# EAGLE design Micro_Rev1j (EAGLE 7.7.0)
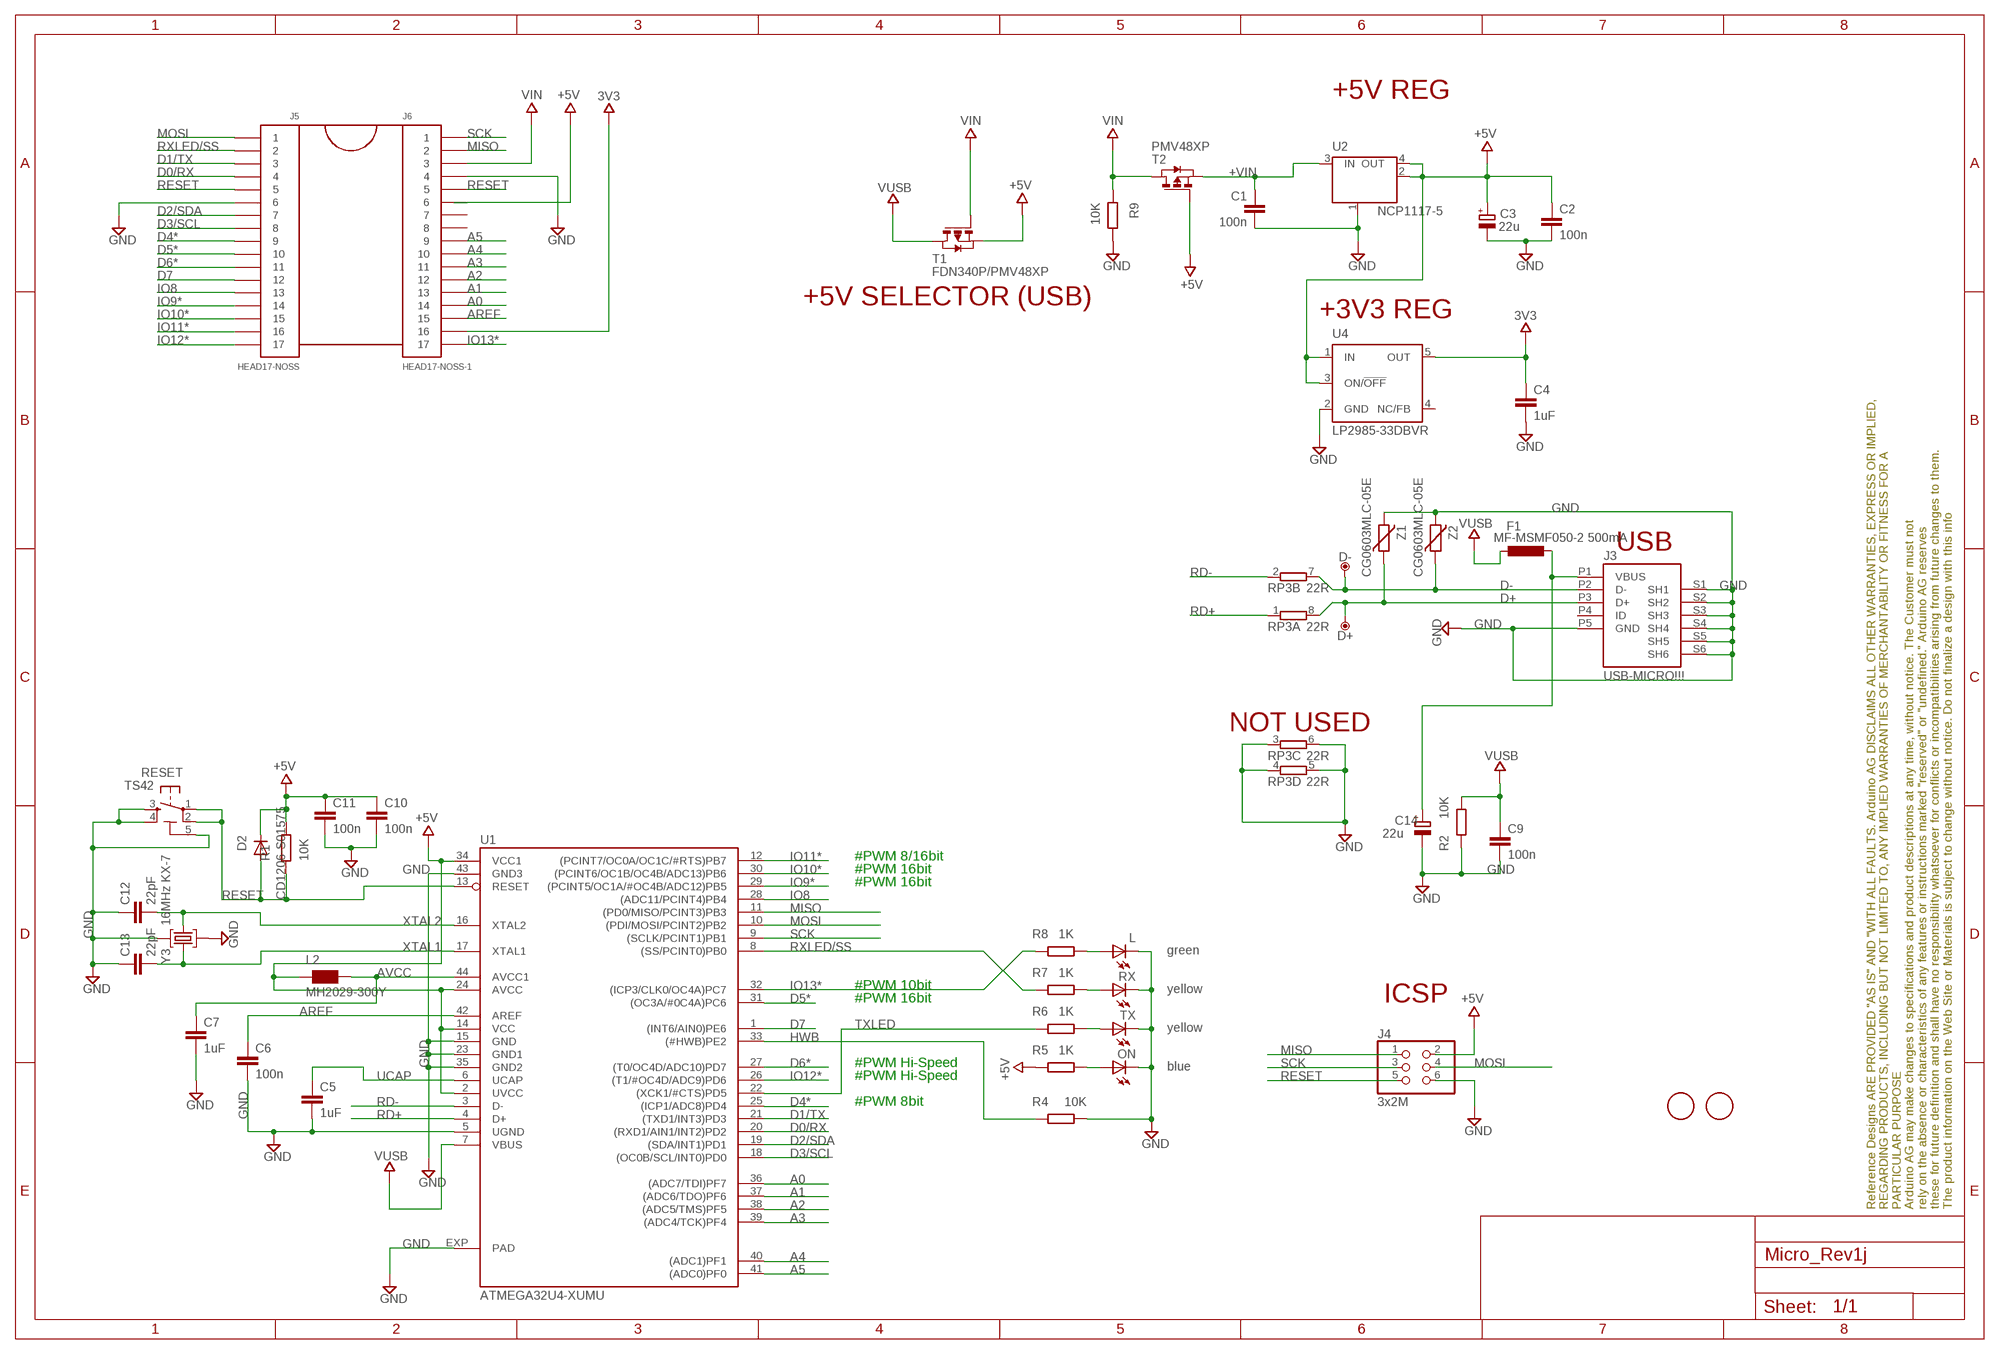
[diagram p0: schematic, sheet 1]

## Parts
C1  100n  C-EUC0402  [C0402]
C2  100n  C-EUC0402  [C0402]
C3  22u  CPOL-EUSMCB  [SMC_B]
C4  1uF  C-EUC0402  [C0402]
C5  1uF  C-EUC0402  [C0402]
C6  100n  C-EUC0402  [C0402]
C7  1uF  C-EUC0402  [C0402]
C9  100n  C-EUC0402  [C0402]
C10  100n  C-EUC0402  [C0402]
C11  100n  C-EUC0402  [C0402]
C12  22pF  C-EUC0402  [C0402]
C13  22pF  C-EUC0402  [C0402]
C14  22u  CPOL-EUSMCB  [SMC_B]
D2  CD1206-S01575  DIODE-MINIMELF  [MINIMELF]
D+  DNP  TPTP-1.00MM  [TP-1.00MM]
D-  DNP  TPTP-1.00MM  [TP-1.00MM]
F1  MF-MSMF050-2 500mA  L-EUL1812  [L1812]
FRAME1  DNP  A3-FRAME-STANDARD  [FRAME]
J3  USB-MICRO!!!  MYCON2_USB-MINI-B  [CON2_USB_MICRO_B_AT]
J4  3x2M  PINHD-2X3  [2X03]
J5  HEAD17-NOSS  [HEAD17-NOSS]
J6  HEAD17-NOSS-1  [HEAD17-NOSS-1]
L  green  LEDCHIPLED_0805  [CHIPLED_0805]
L2  MH2029-300Y  WE-CBF_0805  [0805]
ON  blue  LEDCHIPLED_0805  [CHIPLED_0805]
R1  10K  R-EU_R0402  [R0402]
R2  10K  R-EU_R0402  [R0402]
R4  10K  R-EU_R0402  [R0402]
R5  1K  R-EU_R0402  [R0402]
R6  1K  R-EU_R0402  [R0402]
R7  1K  R-EU_R0402  [R0402]
R8  1K  R-EU_R0402  [R0402]
R9  10K  R-EU_R0402  [R0402]
RESET  TS42  [TS42]
RP3  22R  4R-NCAY16  [CAY16]
RX  yellow  LEDCHIPLED_0805  [CHIPLED_0805]
T1  FDN340P/PMV48XP  PMOSSOT23  [SOT-23]
T2  PMV48XP  PMOSSOT23  [SOT-23]
TX  yellow  LEDCHIPLED_0805  [CHIPLED_0805]
U1  ATMEGA32U4-XUMU  [QFN44ML7X7]
U2  NCP1117-5  LINEAR_MC33269ST  [SOT223]
U4  LP2985-33DBVR  LP2985-XXDBVR33  [SOT23-DBV]
U$37  DNP  FIDUCIAL-1.5MM  [FD-1-1.5]
U$53  DNP  FIDUCIAL-1.5MM  [FD-1-1.5]
Y3  16MHz KX-7  CRYSTAL-3.2-2.5  [CRYSTAL-3.2-2.5]
Z1  CG0603MLC-05E  VARISTORCN0603  [CT/CN0603]
Z2  CG0603MLC-05E  VARISTORCN0603  [CT/CN0603]

## Nets
3V3: C4.1 J6.16 U4.5(OUT)
+5V: C2.1 C3.+ C10.1 C11.1 D2.C J4.2 J6.6 L2.1 R1.1 R5.1 T1.2(S) T2.3(G) U1.2(UVCC) U1.14(VCC) U1.24(AVCC) U1.34(VCC1) U2.2(OUT) U2.4(OUT) U4.1(IN) U4.3(ON/!OFF)
+VIN: C1.1 T2.2(S) U2.3(IN)
A0: J6.14 U1.36((ADC7/TDI)PF7)
A1: J6.13 U1.37((ADC6/TDO)PF6)
A2: J6.12 U1.38((ADC5/TMS)PF5)
A3: J6.11 U1.39((ADC4/TCK)PF4)
A4: J6.10 U1.40((ADC1)PF1)
A5: J6.9 U1.41((ADC0)PF0)
AREF: C6.1 J6.15 U1.42(AREF)
AVCC: C7.1 L2.2 U1.44(AVCC1)
D0/RX: J5.4 U1.20((RXD1/AIN1/INT2)PD2)
D1/TX: J5.3 U1.21((TXD1/INT3)PD3)
D2/SDA: J5.7 U1.19((SDA/INT1)PD1)
D3/SCL: J5.8 U1.18((OC0B/SCL/INT0)PD0)
D4*: J5.9 U1.25((ICP1/ADC8)PD4)
D5*: J5.10 U1.31((OC3A/#0C4A)PC6)
D6*: J5.11 U1.27((T0/OC4D/ADC10)PD7)
D7: J5.12 U1.1((INT6/AIN0)PE6)
D+: D+.X J3.P3(D+) RP3.8 Z1.1
D-: D-.X J3.P2(D-) RP3.7 Z2.1
GND: C1.2 C2.2 C3.- C4.2 C5.2 C6.2 C7.2 C9.2 C10.2 C11.2 C12.1 C13.1 C14.- J3.P5(GND) J3.S1(SH1) J3.S2(SH2) J3.S3(SH3) J3.S4(SH4) J3.S5(SH5) J3.S6(SH6) J4.6 J5.6 J6.4 L.C ON.C R2.1 R4.2 R9.1 RESET.3 RESET.4 RESET.5(5-GND) RP3.3 RP3.4 RP3.5 RP3.6 RX.C TX.C U1.5(UGND) U1.15(GND) U1.23(GND1) U1.35(GND2) U1.43(GND3) U1.EXP(PAD) U2.1(GND/ADJ) U4.2(GND) Y3.2(GND) Y3.4(GND) Z1.2 Z2.2
HWB: R4.1 U1.33((#HWB)PE2)
IO8: J5.13 U1.28((ADC11/PCINT4)PB4)
IO9*: J5.14 U1.29((PCINT5/OC1A/#OC4B/ADC12)PB5)
IO10*: J5.15 U1.30((PCINT6/OC1B/OC4B/ADC13)PB6)
IO11*: J5.16 U1.12((PCINT7/OC0A/OC1C/#RTS)PB7)
IO12*: J5.17 U1.26((T1/#OC4D/ADC9)PD6)
IO13*: J6.17 R8.1 U1.32((ICP3/CLK0/OC4A)PC7)
MISO: J4.1 J6.2 U1.11((PD0/MISO/PCINT3)PB3)
MOSI: J4.4 J5.1 U1.10((PDI/MOSI/PCINT2)PB2)
N$2: R7.2 RX.A
N$3: ON.A R5.2
N$4: R6.2 TX.A
N$7: L.A R8.2
RD+: RP3.1 U1.4(D+)
RD-: RP3.2 U1.3(D-)
RESET: D2.A J4.5 J5.5 J6.5 R1.2 RESET.1 RESET.2 U1.13(RESET)
RXLED/SS: J5.2 R7.1 U1.8((SS/PCINT0)PB0)
SCK: J4.3 J6.1 U1.9((SCLK/PCINT1)PB1)
TXLED: R6.1 U1.22((XCK1/#CTS)PD5)
UCAP: C5.1 U1.6(UCAP)
VIN: J6.3 R9.2 T1.3(G) T2.1(D)
VUSB: C9.1 F1.2 R2.2 T1.1(D) U1.7(VBUS)
VUSBD: C14.+ F1.1 J3.P1(VBUS)
XTAL1: C13.2 U1.17(XTAL1) Y3.3(C2)
XTAL2: C12.2 U1.16(XTAL2) Y3.1(C1)
Unconnected: J3.P4(ID) J6.7 J6.8 U4.4(NC/FB)

## Notes on the sheet
- +5V REG
- +5V SELECTOR (USB)
- +3V3 REG
- USB
- NOT USED
- #PWM 8/16bit
- #PWM 16bit
- #PWM 16bit
- #PWM 10bit
- #PWM 16bit | ICSP
- #PWM Hi-Speed
- #PWM Hi-Speed
- #PWM 8bit

## Library data of the parts
C1 C2 C4-C7 C9-C13 = gen_comp:C-EU: CAPACITOR, European symbol
C3 C14 = rcl:CPOL-EU: POLARIZED CAPACITOR, European symbol
D2 = diode:DIODE-: DIODE
D+ D- = Arduino-utility:TP: Testpoint; DATASHEET: DNP; DISTRIBUTOR-LINK: DNP; DISTRIBUTOR-PN: DNP; MANUFACTURER: DNP; MANUFACTURER-PN: DNP
F1 = rcl:L-EU: INDUCTOR, European symbol
FRAME1 = Arduino-utility:A3-FRAME: Schematic frame; DATASHEET: DNP; DISTRIBUTOR-LINK: DNP; DISTRIBUTOR-PN: DNP; MANUFACTURER: DNP; MANUFACTURER-PN: DNP
J3 = gen_comp:MYCON2_USB-MINI-B
J4 = gen_comp:PINHD-2X3: PIN HEADER
J5 = gen_comp:HEAD17-NOSS
J6 = gen_comp:HEAD17-NOSS-1
L ON RX TX = led:LED: LED OSRAM: - CHIPLED LG R971, LG N971, LY N971, LG Q971, LY Q971, LO R971, LY R971 LH N974, LH R974 LS Q976, LO Q976, LY Q976 LO Q996 - Hyper CHIPLED LW Q18S LB Q993, LB Q99A, LB R99A - SideLED LS A670, LO A670, LY A670, LG A670, LP A670 LB A673, LV A673, LT A673, LW A673 LH A674 LY A675 LS A676, LA A676, LO A676, LY A676, LW A676 LS A679, LY A679, LG A679 - Hyper Micro SIDELED® LS Y876, LA Y876, LO Y876, LY Y876 LT Y87S - SmartLED LW L88C, LW L88S LB L89C, LB L89S, LG L890 LS L89K, LO L89K, LY L89K LS L896, LA L896, LO L896, LY L896 - TOPLED LS T670, LO T670, LY T670, LG T670, LP T670 LSG T670, LSP T670, LSY T670, LOP T670, LYG T670 LG T671, LOG T671, LSG T671 LB T673, LV T673, LT T673, LW T673 LH T674 LS T676, LA T676, LO T676, LY T676, LB T676, LH T676, LSB T676, LW T676 LB T67C, LV T67C, LT T67C, LS T67K, LO T67K, LY T67K, LW E67C LS E67B, LA E67B, LO E67B, LY E67B, LB E67C, LV E67C, LT E67C LW T67C LS T679, LY T679, LG T679 LS T770, LO T770, LY T770, LG T770, LP T770 LB T773, LV T773, LT T773, LW T773 LH T774 LS E675, LA E675, LY E675, LS T675 LS T776, LA T776, LO T776, LY T776, LB T776 LHGB T686 LT T68C, LB T68C - Hyper Mini TOPLED® LB M676 - Mini TOPLED Santana® LG M470 LS M47K, LO M47K, LY M47K Source: http://www.osram.convergy.de LUXEON: - LUMILED® LXK2-PW12-R00, LXK2-PW12-S00, LXK2-PW14-U00, LXK2-PW14-V00 LXK2-PM12-R00, LXK2-PM12-S00, LXK2-PM14-U00 LXK2-PE12-Q00, LXK2-PE12-R00, LXK2-PE12-S00, LXK2-PE14-T00, LXK2-PE14-U00 LXK2-PB12-K00, LXK2-PB12-L00, LXK2-PB12-M00, LXK2-PB14-N00, LXK2-PB14-P00, LXK2-PB14-Q00 LXK2-PR12-L00, LXK2-PR12-M00, LXK2-PR14-Q00, LXK2-PR14-R00 LXK2-PD12-Q00, LXK2-PD12-R00, LXK2-PD12-S00 LXK2-PH12-R00, LXK2-PH12-S00 LXK2-PL12-P00, LXK2-PL12-Q00, LXK2-PL12-R00 Source: www.luxeon.com KINGBRIGHT: KA-3528ASYC Source: www.kingbright.com
L2 = wuerth-elektronik:WE-CBF: SMD EMI Suppression Ferrite Beads - excellent anti-EMI properties - low DCR - impedances till 3000 ohms - rated current up to 6 A
R1 R2 R4-R9 = gen_comp:R-EU_: RESISTOR, European symbol
RESET = Arduino:TS42: TS42 Dongnan Electronics Tact switch VDC 12V - 50mA
RP3 = resistor-dil:4R-N: Array Chip Resistor Source: RS Component / Phycomp
T1 T2 = zetex:PMOSSOT23: MOS FET
U1 = gen_comp:ATMEGA32U4-XU
U2 = gen_comp:LINEAR_MC33269ST*: Adjustable Output Low Dropout Voltage Regulator 800 mA Source: http://www.onsemi.com/pub/Collateral/MC33269-D.PDF
U4 = gen_comp:LP2985-XXDBVR: ULTRALOW-POWER 50-mA LOW-DROPOUT LINEAR REGULATORS 50-mA Low-Dropout Regulator Source: http://focus.ti.com/lit/ds/symlink/tps77001.pdf
U$37 U$53 = Arduino-utility:FIDUCIAL: Fiducial mount; DATASHEET: DNP; DISTRIBUTOR-LINK: DNP; DISTRIBUTOR-PN: DNP; MANUFACTURER: DNP; MANUFACTURER-PN: DNP
Y3 = gen_comp:CRYSTAL-3.2-2.5
Z1 Z2 = varistor:VARISTOR: VARISTOR

## Net classes
0 default: width 0.254 mm, drill 0.5 mm, clearance 0.203 mm

## Board
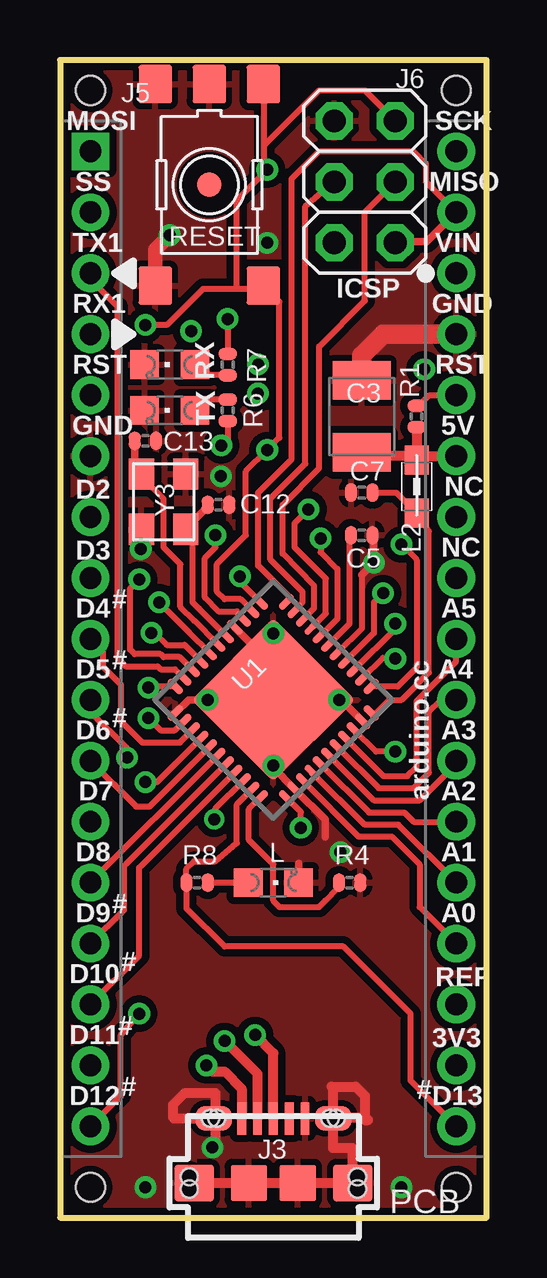
[diagram p1: board, top side]
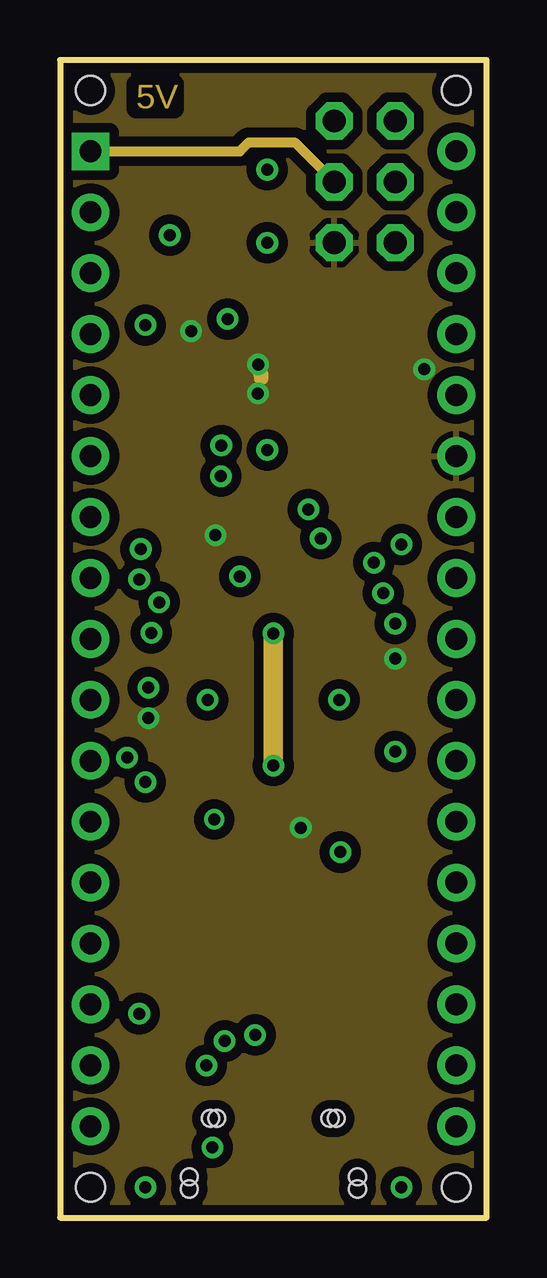
[diagram p2: board, inner layer POWER]
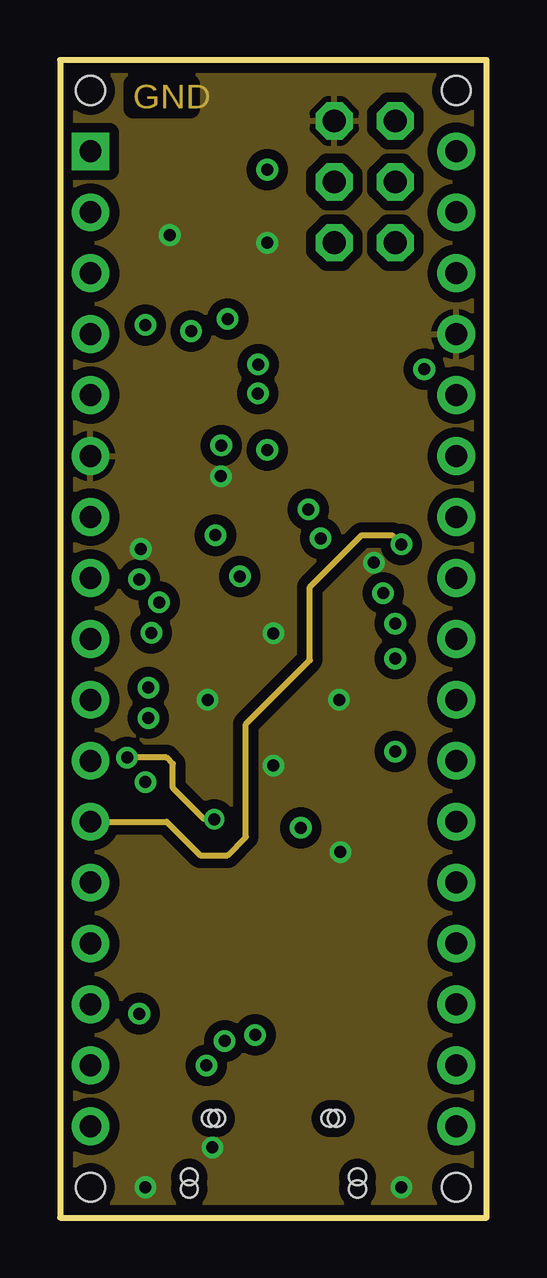
[diagram p3: board, inner layer GROUND]
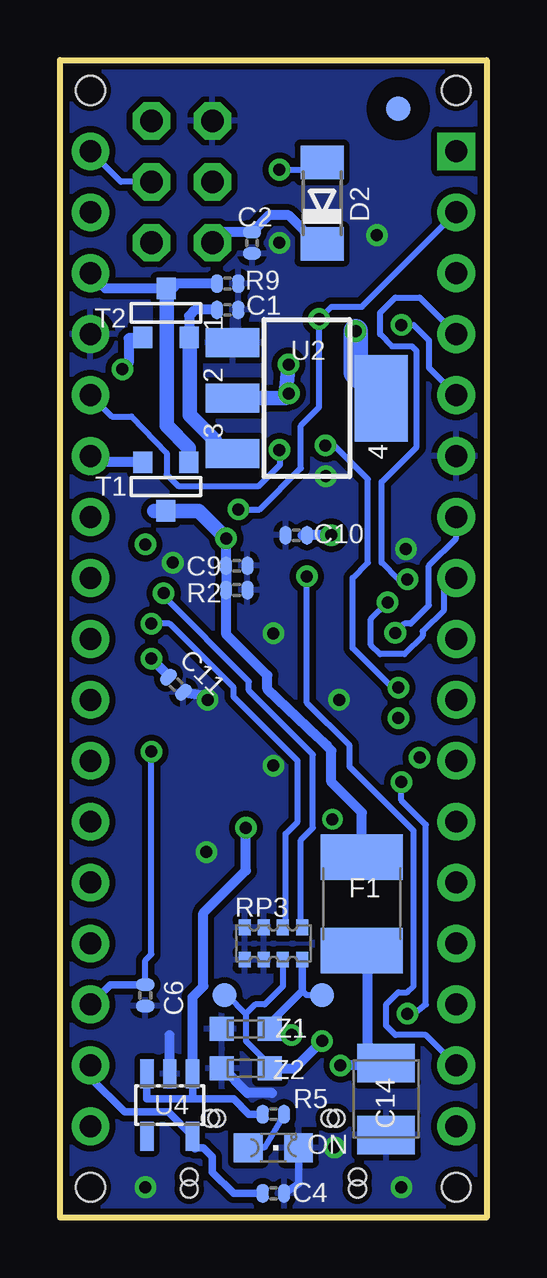
[diagram p4: board, bottom side, seen from below]

Size 17.78 x 48.26 mm. Coordinates in mm from the lower left corner, seen from the top.
Outline: 0,0 17.78,0 17.78,48.26 0,48.26 0,0
Copper layers (1*2*15*16): Top 0.035mm / dielectric 0.2mm / POWER 0.0175mm / dielectric 0.3mm / GROUND 0.0175mm / dielectric 0.2mm / Bottom 0.035mm
Design rules "SystemElettronica": minimum track width 6mil, minimum drill 0.499mm, track to track 6mil, track to pad 6mil, pad to pad 5mil, via to via 5mil, smd to smd 0mil, copper to edge 10mil, drill to drill 8mil, minimum pad ring 6mil, minimum via ring 4mil, stop-mask expansion 4mil, vias tented up to drill 25mil, thermal gap 10mil
Holes 1.2 mm at 1.27,1.27 16.51,1.27 1.27,46.99 16.51,46.99

### Footprints (pad centres in the part's own frame; a part is rotated, then mirrored left to right if it is on the bottom)
C0402 = smd 0.508 x 0.762: 1 -0.445,0; 2 0.445,0
SMC_B = smd 1.6 x 2.4: + -1.5,0; - 1.5,0
MINIMELF = smd 1.4 x 1.8: A 1.7,0; C -1.7,0
TP-1.00MM = smd 1 x 1 bottom: X 0,0
L1812 = smd 1.9 x 3.4: 1 -1.95,0; 2 1.95,0
CON2_USB_MICRO_B_AT = smd 0.406 x 1.346: P1 -1.321,2.692; P2 -0.66,2.692; P3 0,2.692; P4 0.66,2.692; P5 1.321,2.692 | smd 1.651 x 1.549: S1 -3.302,0; S2 3.302,0 | smd 1.524 x 1.016: S3 -2.489,2.692; S4 2.489,2.692 | smd 1.524 x 1.524: S5 -1.016,0; S6 1.016,0 | hole 0.7: -3.505,0.254; -3.505,-0.254; 3.505,0.254; 3.505,-0.254; -2.616,2.692; -2.362,2.692; 2.362,2.692; 2.616,2.692
2X03 = drill 0.95 pad 1.55 octagon: 1 -2.54,-1.27; 2 -2.54,1.27; 3 0,-1.27; 4 0,1.27; 5 2.54,-1.27; 6 2.54,1.27
HEAD17-NOSS = drill 0.914 pad 1.575 square: 1 0,0 | drill 0.914 pad 1.575: 2 2.54,0; 3 5.08,0; 4 7.62,0; 5 10.16,0; 6 12.7,0; 7 15.24,0; 8 17.78,0; 9 20.32,0; 10 22.86,0; 11 25.4,0; 12 27.94,0; 13 30.48,0; 14 33.02,0; 15 35.56,0; 16 38.1,0; 17 40.64,0
HEAD17-NOSS-1 = drill 0.914 pad 1.575: 1 0,0; 2 2.54,0; 3 5.08,0; 4 7.62,0; 5 10.16,0; 6 12.7,0; 7 15.24,0; 8 17.78,0; 9 20.32,0; 10 22.86,0; 11 25.4,0; 12 27.94,0; 13 30.48,0; 14 33.02,0; 15 35.56,0; 16 38.1,0; 17 40.64,0
CHIPLED_0805 = smd 1.2 x 1.2: A 0,-1.05; C 0,1.05
0805 = smd 1.2 x 1: 1 -1.1,0; 2 1.1,0
R0402 = smd 0.508 x 0.762: 1 -0.445,0; 2 0.445,0
TS42 = smd 1.6 x 1.4: 1 -4.2,2.25; 2 4.2,2.25; 3 -4.2,-2.25; 4 4.2,-2.25; 5 -4.2,0
CAY16 = smd 0.5 x 0.65: 1 -1.2,-0.675; 2 -0.4,-0.675; 3 0.4,-0.675; 4 1.2,-0.675; 5 1.2,0.675; 6 0.4,0.675; 7 -0.4,0.675; 8 -1.2,0.675
SOT-23 = smd 0.787 x 0.889: 1 0.025,-1.016; 2 -0.94,1.016; 3 0.991,1.016
QFN44ML7X7 = smd 0.75 x 0.275: 1 -3.275,2.5; 2 -3.275,2; 3 -3.275,1.5; 4 -3.275,1; 5 -3.275,0.5; 6 -3.275,0; 7 -3.275,-0.5; 8 -3.275,-1; 9 -3.275,-1.5; 10 -3.275,-2; 11 -3.275,-2.5; 23 3.275,-2.5; 24 3.275,-2; 25 3.275,-1.5; 26 3.275,-1; 27 3.275,-0.5; 28 3.275,0; 29 3.275,0.5; 30 3.275,1; 31 3.275,1.5; 32 3.275,2; 33 3.275,2.5 | smd 0.275 x 0.75: 12 -2.5,-3.275; 13 -2,-3.275; 14 -1.5,-3.275; 15 -1,-3.275; 16 -0.5,-3.275; 17 0,-3.275; 18 0.5,-3.275; 19 1,-3.275; 20 1.5,-3.275; 21 2,-3.275; 22 2.5,-3.275; 34 2.5,3.275; 35 2,3.275; 36 1.5,3.275; 37 1,3.275; 38 0.5,3.275; 39 0,3.275; 40 -0.5,3.275; 41 -1,3.275; 42 -1.5,3.275; 43 -2,3.275; 44 -2.5,3.275 | smd 4.826 x 4.826: EXP 0,0
SOT223 = smd 1.219 x 2.235: 1 -2.311,-3.099; 2 0,-3.099; 3 2.311,-3.099 | smd 3.6 x 2.2: 4 0,3.099
SOT23-DBV = smd 0.55 x 1.2: 1 -0.95,-1.3; 2 0,-1.3; 3 0.95,-1.3; 4 0.95,1.3; 5 -0.95,1.3
FD-1-1.5 = smd 1.016 x 1.016: P$1 0,0
CRYSTAL-3.2-2.5 = smd 1.3 x 1.05: 1 -1.15,-0.925; 2 1.15,-0.925; 3 1.15,0.925; 4 -1.15,0.925
CT/CN0603 = smd 1 x 1: 1 -1,0; 2 1,0

### Placement (x,y rotation side)
C1  10.79,37.85 0 bottom
C2  9.78,40.64 270 bottom
C3  12.57,33.4 90 top
C4  8.89,1.02 0 bottom
C5  12.57,28.45 0 top
C6  14.22,9.27 270 bottom
C7  12.57,30.23 180 top
C9  10.41,27.18 0 bottom
C10  7.94,28.45 180 bottom
C11  12.95,22.23 315 bottom
C12  6.6,29.72 180 top
C13  3.56,32.38 180 top
C14  4.19,4.95 270 bottom
D2  6.86,42.29 90 bottom
D+  6.86,9.27 0 top
D-  10.92,9.27 0 top
F1  5.21,13.08 90 bottom
FRAME1  -59.18,-6.35 0 top  (outside the outline)
J3  8.89,1.45 0 top
J4  12.7,43.18 90 top
J5  1.27,44.45 270 top
J6  16.51,44.45 270 top
L  8.89,13.97 270 top
L2  14.86,30.48 270 top
ON  8.89,2.92 270 bottom
R1  14.86,33.4 90 top
R2  10.41,26.16 180 bottom
R4  12.06,13.97 0 top
R5  8.89,4.32 0 bottom
R6  6.99,33.66 90 top
R7  6.99,35.56 270 top
R8  5.71,13.97 0 top
R9  10.79,38.94 180 bottom
RESET  6.22,43.05 270 top
RP3  8.89,11.43 180 bottom
RX  4.57,35.56 90 top
T1  13.4,30.48 0 bottom
T2  13.34,37.72 180 bottom
TX  4.57,33.66 90 top
U1  8.89,21.59 225 top
U2  7.49,34.16 270 bottom
U4  13.21,4.7 180 bottom
U$37  6.22,43.05 0 top
U$53  3.68,46.23 0 bottom
Y3  4.32,29.84 90 top
Z1  10.03,7.87 180 bottom
Z2  10.03,6.22 180 bottom

### Tracks (layer width: path | path; a pad name or v marks a point on that pad's centre or on a via)
3V3
  Bottom 0.305: U4.5 13.28,4.42 15.09,4.42 16.51,5.84 J6.16 | 12.16,2.92 11.81,2.92 11.43,2.54 11.43,1.91 10.54,1.02 C4.1
  Bottom 0.406: 12.16,2.92 U4.5
+5V  (via drill 0.5 pad 0.9)
  Top 0.254: U1.24 4.79,20.32 4.19,20.32 v3.68,20.83 | U1.14 7.37,25.27 6.6,25.27 6.03,25.84 6.03,27.5 6.48,27.94 v6.48,28.45 | U1.2 13.46,23.33 v13.97,23.3 | U1.34 10.03,16.91 v10.03,16.26
  Top 0.406: R1.1 L2.1 14.73,31.58 14.73,31.75 | 14.73,31.75 J6.6 | 14.73,31.75 12.57,31.75 C3.+
  POWER 0.61: v8.26,35.57 8.38,35.06 8.38,35.14 8.39,35.14 8.39,35
  Bottom 0.305: U4.1 12.26,4.95 | 12.26,4.95 10.54,4.95 9.91,4.32 R5.1 | U4.3 14.16,4.95 12.26,4.95
  Bottom 0.406: v10.03,16.26 10.03,14.48 11.81,12.7 11.81,9.65 12.26,9.21 U4.1 | C11.1 13.41,22.75 v13.97,23.3 | 7.68,28.45 C10.1 v6.48,28.45 | D2.C 7.06,40.59 8.26,41.78 9.08,41.78 C2.1 10.99,41.08 J4.2 | T1.2 16.26,31.5 J6.6 | T2.3 14.92,36.66 14.92,35.62 v15.18,35.37
  Bottom 0.61: U2.2 8.38,34.16 v8.26,35.57
  Bottom 1.016: v5.46,36.96 5.46,35.23 U2.4
  other vias: 8.25,34.36
  pour POWER (isolate 0.406): -0.64,48.9 18.41,48.9 18.41,-0.64 -0.64,-0.64
+VIN
  Bottom 0.406: C1.1 12.14,37.85 12.39,37.59 T2.2
  Bottom 0.61: U2.3 11.34,31.85 11.34,32.42 12.38,33.47 12.38,35.99 T2.2
A0
  Top 0.254: U1.36 12.45,15.88 13.84,15.88 14.99,14.73 14.99,12.95 J6.14
A1
  Top 0.254: U1.37 12.7,16.38 14.1,16.38 J6.13
A2
  Top 0.254: U1.38 12.88,16.89 | 12.88,16.89 | 12.88,16.89 14.35,16.89 14.73,16.51 J6.12
A3
  Top 0.254: U1.39 13.08,17.4 14.99,17.4 16.26,18.67 J6.11
A4
  Top 0.254: U1.40 13.28,17.91 14.73,17.91 15.37,18.54 15.37,21.08 15.88,21.59 J6.10
A5
  Top 0.254: U1.41 13.48,18.41 14.48,18.41 14.86,18.8 14.86,21.54 16.51,23.19 J6.9
AREF  (via drill 0.5 pad 0.9)
  Top 0.254: U1.42 13.17,19.43 v13.97,19.43
  Bottom 0.254: v13.97,19.43 13.97,10.99 14.22,10.73 C6.1
  Bottom 0.305: C6.1 15.68,9.72 J6.15
AVCC
  Top 0.254: U1.44 13.17,21.04 13.72,21.59 14.24,21.59 15.37,22.72 15.37,28.62 L2.2 14.01,30.23 C7.1
D0/RX  (via drill 0.5 pad 0.9)
  Top 0.254: U1.20 4.99,23.37 4.32,23.37 4.19,23.5 3.11,23.5 2.92,23.69 2.92,26.23 v3.3,26.61
  Bottom 0.254: v3.3,26.61 3.68,26.61 4.38,27.3 4.38,30.67 2.92,32.13 2.92,36.13 3.11,36.32 3.94,36.32 4.45,36.83 4.45,37.72 3.81,38.35 2.79,38.35 J5.4
D1/TX
  Top 0.254: U1.21 4.79,22.86 4.19,22.86 4.06,22.99 2.73,22.99 2.41,23.3 2.41,37.97 1.27,39.12 J5.3
D2/SDA  (via drill 0.5 pad 0.9)
  Top 0.254: U1.19 5.19,23.88 4.45,23.88 3.94,24.38 v3.81,24.38
  Bottom 0.254: v3.81,24.38 3.43,24.77 3.17,24.77 2.41,25.53 2.41,27.18 1.27,28.32 J5.7
D3/SCL  (via drill 0.5 pad 0.9)
  Top 0.254: U1.18 5.39,24.38 5.4,24.38 v4.13,25.65
  Bottom 0.254: v4.13,25.65 4.83,24.96 4.83,23.88 4.45,23.5 3.43,23.5 2.67,24.26 2.67,24.45 1.78,25.34 1.78,26.16 J5.8
D4*
  Top 0.254: U1.25 4.99,19.81 3.43,19.81 2.54,20.7 2.54,22.23 1.78,22.99 1.78,23.62 J5.9
D5*  (via drill 0.5 pad 0.85, 0.5 pad 0.9)
  Top 0.254: U1.31 6.48,17.06 v6.43,16.61 | J5.10 1.27,21.08 2.79,19.56 v2.79,19.18
  GROUND 0.254: v2.79,19.18 4.45,19.18 4.7,18.92 4.7,17.91 5.97,16.64 v6.43,16.61
D6*
  Top 0.254: U1.27 3.74,17.14 3.17,17.14 J5.11
D7  (via drill 0.5 pad 0.9)
  Top 0.254: U1.1 14.06,22.14 14.06,22.13 14.86,22.94 14.86,27.43 v14.22,28.07
  GROUND 0.254: J5.12 4.45,16.51 5.84,15.11 6.99,15.11 7.75,15.88 7.75,20.57 10.41,23.24 10.41,26.29 12.57,28.45 13.84,28.45 v14.22,28.07
D+  (via drill 0.5 pad 0.9)
  Top 0.406: J3.P3 8.89,6.86 v8.13,7.62
  Bottom 0.254: D+.X 7.51,9.27 7.69,9.46
  Bottom 0.305: RP3.8 7.69,9.46 9.27,7.87 9.14,7.87
  Bottom 0.406: v8.13,7.62 Z1.1 9.14,7.87
D-  (via drill 0.5 pad 0.9)
  Top 0.406: J3.P2 8.23,5.99 v6.86,7.37
  Bottom 0.254: RP3.7 8.49,9.65 9.25,8.89 9.65,8.89 10.03,8.51 | 10.03,8.51 10.03,7.37 9.03,6.37 Z2.1 | D-.X 10.79,9.27 10.03,8.51
  Bottom 0.406: Z2.1 8,6.22 v6.86,7.37
GND  (via drill 0.5 pad 0.9)
  Top 0.254: U1.EXP v8.89,24.36 | U1.5 12.57,24.57 12.57,26.8 | 13.04,28.19 C5.2
  Top 0.305: U1.EXP 8.89,18.76 U1.35 11.05,16.6 11.05,15.88 | U1.23 5.35,21.59 U1.EXP | U1.15 8.89,23 U1.EXP | L.C 9.94,14.77 | 12.57,26.8 v13.08,27.3 13.08,28.28 13.04,28.19 | U1.43 11.72,21.59 v11.63,21.59
  Top 0.406: J3.S1 J3.S2 12.19,2.9 11.38,2.9 J3.S4 | 6.22,3.05 v6.35,2.93 6.48,3.05 6.48,5.21 5.21,5.21 4.7,4.7 4.7,4.19 4.75,4.14 J3.S3 | J3.S4 11.38,5.38 11.3,5.46 12.32,5.46 12.7,5.08 12.7,4.19 12.83,4.06 12.7,4.06 12.57,4.19 11.43,4.19 J3.S4
  Top 0.61: RESET.4 3.97,40.36 v4.57,40.96 | Y3.4 3.39,28.09 v3.37,27.88
  Top 0.813: C3.- 12.57,35.94 13.46,36.83 J6.4
  POWER 0.813: v8.89,24.36 v8.89,18.85
  Bottom 0.305: ON.C 7.84,1.42 C4.2
  Bottom 0.406: U4.2 13.21,7.62 | C11.2 11.81,21.77 v11.63,21.59 | 8.95,5.21 9.97,5.21 11.05,6.29
  other vias: 11.68,15.24 6.71,30.91 6.15,21.59 3.56,1.27 14.22,1.27 8.64,40.64
  pour GROUND (isolate 0.406): -1.27,49.53 19.05,49.53 19.05,-1.27 -1.27,-1.27
  pour Bottom (isolate 0.254): 19.68,50.16 -1.91,50.16 -1.91,-1.91 19.68,-1.91
  pour Top (isolate 0.305): -2.54,50.8 20.32,50.8 20.32,-2.54 -2.54,-2.54
HWB
  Top 0.254: U1.33 7.87,17.04 7.87,15.75 8.89,14.73 8.89,13.21 9.14,12.95 10.79,12.95 11.05,13.21 11.56,13.73 R4.1
IO8
  Top 0.254: J5.13 U1.28
IO9*
  Top 0.254: U1.29 2.67,14.66 2.67,12.83 J5.14
IO10*
  Top 0.254: U1.30 3.3,14.59 3.3,10.92 J5.15
IO11*  (via drill 0.5 pad 0.9)
  Top 0.254: U1.12 7.49,26.52 v7.49,26.73
  Bottom 0.254: v7.49,26.73 7.49,21.46 5.71,19.68 5.71,18.8 3.05,16.13 3.05,9.65 3.3,9.4 3.68,9.4 4.19,8.89 4.19,8 3.81,7.62 2.54,7.62 J5.16
IO12*  (via drill 0.5 pad 0.9)
  Top 0.254: J5.17 2.54,5.08 2.54,7.62 v3.3,8.51 | U1.26 4.05,18.16 v3.56,18.16
  Bottom 0.254: v3.3,8.51 3.05,8.51 2.54,8.89 2.54,16.38 3.56,17.4 v3.56,18.16
IO13*
  Top 0.254: J6.17 14.61,5.71 14.61,8.51 11.81,11.3 6.86,11.3 5.27,12.89 R8.1 5.27,14.54 5.59,14.86 6.48,14.86 7.37,15.62 7.37,17.24 U1.32
MISO
  Top 0.254: U1.11 9.53,25.76 9.53,25.91 8.26,27.18 8.26,30.23 9.65,31.62 9.65,43.31 10.79,44.45 14.73,44.45 15.24,43.94 15.24,43.18 J6.2
  Top 0.305: J6.2 15.28,40.68 14.01,40.68 J4.1
MOSI
  Top 0.254: U1.10 10.11,25.66 10.11,26.09 8.76,27.43 8.76,29.97 10.22,31.43 10.22,42.16 J4.4
  POWER 0.406: J5.1 7.49,44.45 7.87,44.83 9.78,44.83 J4.4
N$2
  Top 0.254: R7.2 5.91,35.12 5.46,35.56 RX.A 5.59,35.56
N$3
  Bottom 0.254: R5.2 9.27,2.92 ON.A
N$4
  Top 0.254: R6.2 6.07,34.1 TX.A
N$7
  Top 0.254: R8.2 L.A
RD+  (via drill 0.5 pad 0.9)
  Top 0.254: U1.4 13.08,24.37 13.08,25.65 v13.46,26.04
  Bottom 0.254: v13.46,26.04 13.46,25.91 9.91,22.35 9.91,21.97 7.24,19.3 7.24,16.26 7.75,15.75 7.75,11.91 RP3.1
RD-  (via drill 0.5 pad 0.9)
  Top 0.254: U1.3 13.97,24.55 v13.97,24.77
  Bottom 0.254: v13.97,24.77 13.21,24.77 10.54,22.1 10.54,21.72 7.87,19.05 7.87,16.51 8.38,16 8.38,11.96 RP3.2
RESET  (via drill 0.5 pad 0.9)
  Top 0.254: U1.13 7.53,25.78 6.86,25.78 6.54,26.1 6.54,27.24 7.75,28.45 7.75,31.11 v8.64,32 9.14,32.51 9.14,38.18 RESET.2 | v8.64,43.69 8.51,43.69 8.51,43.81 | 8.51,43.81 8.51,44.7 | 8.51,44.7 10.79,46.99 12.7,46.99 J4.5 | v3.56,37.21 4.45,37.21 5.96,38.73 8.51,38.73 8.38,38.85 8.38,38.86 8.51,38.86 | RESET.2 8.64,38.85 8.64,38.73 8.51,38.73 | 8.51,38.82 RESET.2 | 8.22,39.11 RESET.2 | RESET.2 8.45,38.83 8.45,38.92 8.47,38.77 | v8.64,43.69 7.37,42.42 7.37,38.73 8.51,38.73 | 8.51,38.73 8.51,38.86 | 8.51,38.86 8.47,38.9 RESET.2 | 8.47,38.77 RESET.2 | 8.47,38.77 8.51,38.73 | 14.9,33.85 14.95,33.85 15.39,34.29 J6.5 | v8.64,43.69 8.51,43.81 | 8.51,44.7 8.51,47.22 RESET.1
  Top 0.305: 14.9,33.85 R1.2
  Bottom 0.254: J5.5 2.41,35.43 2.41,36.58 3.05,37.21 v3.56,37.21 | J6.5 15.62,33.4 14.8,33.4 13.34,31.88 13.34,30.99 12.83,30.48 9.53,30.48 8.61,31.39 8.61,31.85 v8.64,32 | v8.64,43.69 6.86,43.69 D2.A 6.86,44.07
RXLED/SS  (via drill 0.5 pad 0.9)
  Top 0.254: U1.8 11.07,25.19 11.07,26.64 9.78,27.94 9.78,28.96 v10.35,29.53 | v6.99,37.47 R7.1
  Bottom 0.254: v10.35,29.53 9.46,29.53 7.75,31.24 7.75,33.02 6.99,33.78 v6.99,37.47 6.48,37.97 5.21,37.97 J5.2
SCK
  Top 0.254: U1.9 10.59,25.41 10.59,26.34 9.27,27.69 9.27,29.72 10.79,31.24 10.79,36.32 12.7,38.23 12.7,41.91 J4.3
  Bottom 0.254: J4.3 15.24,43.18 J6.1
TXLED  (via drill 0.5 pad 0.9)
  Top 0.254: U1.22 3.77,22.14 v3.68,22.1 | R6.1 6.99,32.46 v6.72,32.19
  Bottom 0.254: v3.68,22.1 3.94,22.1 5.59,23.75 5.59,26.67 4.95,27.3 4.95,30.79 6.36,32.19 v6.72,32.19
UCAP
  Top 0.254: U1.6 12.06,24.77 12.06,28.45 12.08,28.43 C5.1
VIN
  Bottom 0.406: J6.3 15.88,38.73 T2.1 13.08,38.73 12.9,38.94 R9.2
  Bottom 0.61: T1.3 12.41,32.09 13.34,33.02 13.34,38.2 T2.1
VUSB  (via drill 0.5 pad 0.9)
  Top 0.254: U1.7 11.56,24.96 11.56,27.05 10.86,27.75 v10.86,28.32
  Bottom 0.254: 13.72,29.46 13.84,29.46
  Bottom 0.406: 6.6,19.62 6.83,19.84 7.03,20.03 | 7.03,20.03 9.14,22.04 9.14,22.61 10.83,24.3 10.86,24.36 R2.2 C9.1 v10.86,28.32 10.82,28.42 10.9,28.42 | F1.2 5.21,16.89 6.48,18.16 6.48,19.47 7.03,20.03
  Bottom 0.61: 13.84,29.46 T1.1 | T1.1 13.72,29.46 | T1.1 12,29.46 v10.86,28.32
VUSBD  (via drill 0.5 pad 0.9)
  Top 0.406: J3.P1 7.57,5.38 6.86,6.1 6.35,6.1 v6.1,6.35
  Bottom 0.406: F1.1 4.95,10.62 4.95,7.21 C14.+ 4.09,6.35 v6.1,6.35
XTAL1
  Top 0.254: U1.17 5.59,24.89 5.02,25.46 5.02,27.24 4.32,27.94 4.32,29.97 3.46,30.83 | 3.56,30.83 3.46,30.83 | 3.46,30.83 3.43,30.86
  Top 0.305: C13.2 3.11,30.97 Y3.3 3.56,30.83
XTAL2
  Top 0.254: U1.16 5.79,25.4 5.52,25.65 5.52,25.72 5.52,28.37 5.23,28.68 Y3.1 5.21,28.7
  Top 0.305: C12.2 6.16,29.65 5.59,29.08 5.59,29.04 Y3.1

### Text on the board
POWER: 5V
GROUND: GND
tPlace: MOSI | SCK | SS | MISO | TX1 | VIN | RX1 | ICSP | GND | RST | RX | RST | GND | TX | 5V | D2 | NC | NC | D3 | D4 | # | A5 | # | D5 | A4 | D6 | # | A3 | D7 | A2 | D8 | A1 | # | D9 | A0 | D10 | # | REF | # | D11 | 3V3 | D12 | # | # | D13
tNames: C3 | arduino.cc | J3